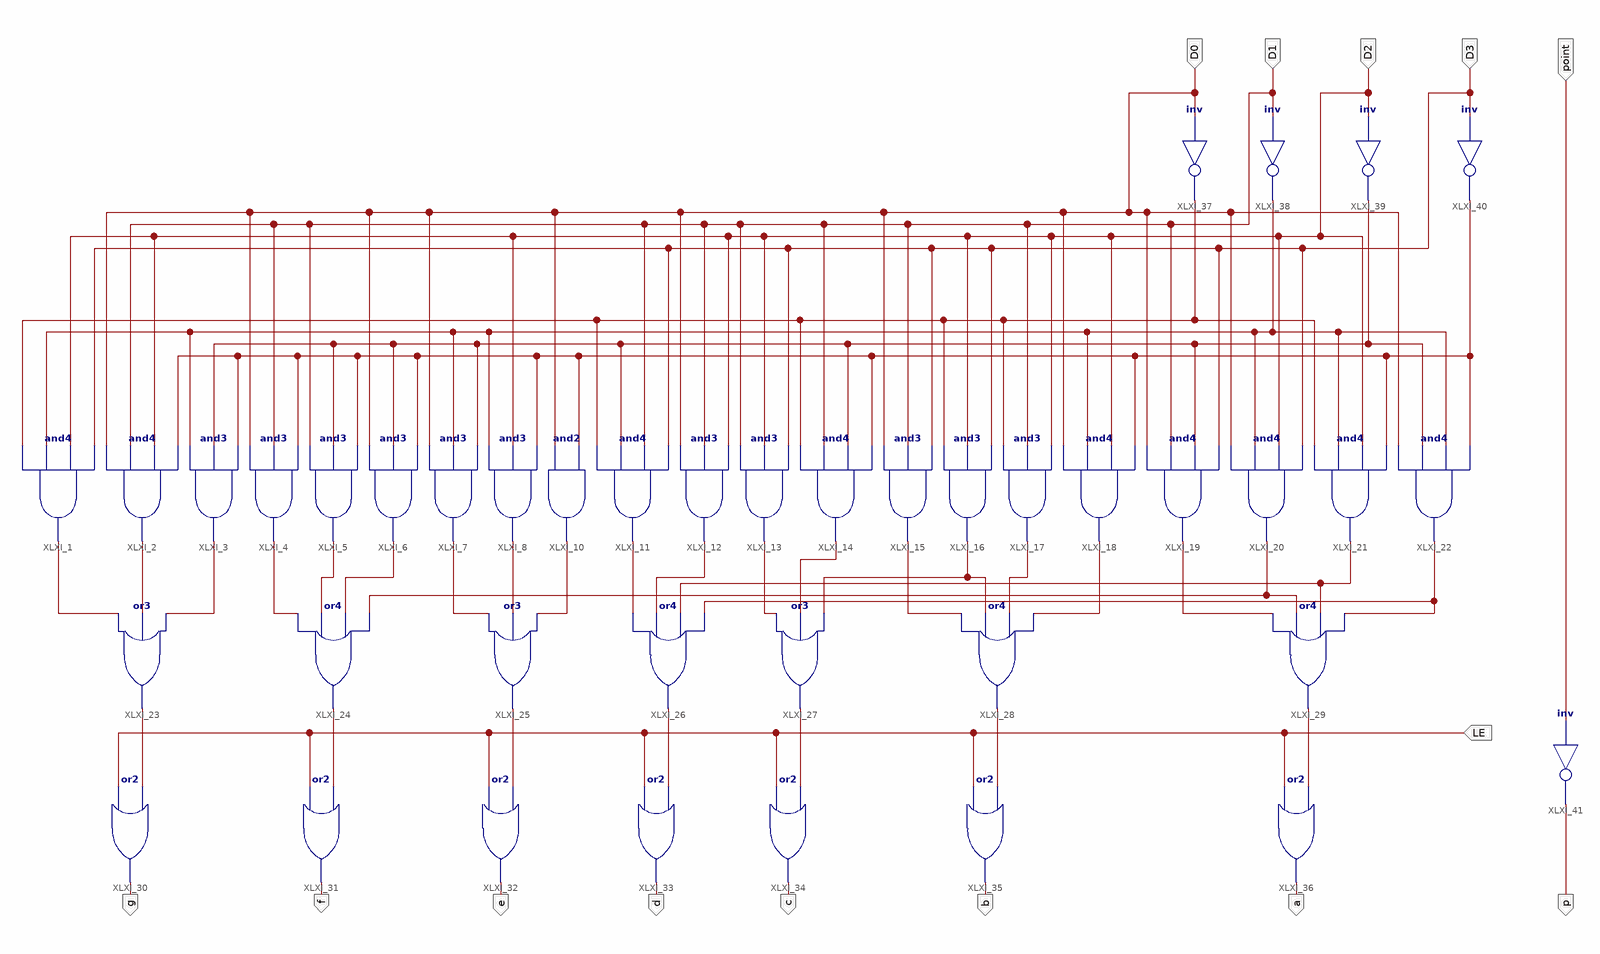
[diagram p0: schematic sheet 1]
// Xilinx ISE schematic MyMC14495.sch (kintex7) as structural Verilog: 40 symbols, 14 ports
module MyMC14495 (
  input  D2,
  input  D3,
  input  D0,
  input  D1,
  input  point,
  input  LE,
  output g,
  output f,
  output e,
  output d,
  output c,
  output b,
  output a,
  output p
);

  wire XLXN_10, XLXN_11, XLXN_13, XLXN_14, XLXN_38, XLXN_39, XLXN_40, XLXN_41, XLXN_42, XLXN_43, XLXN_44,
       XLXN_45, XLXN_46, XLXN_47, XLXN_48, XLXN_49, XLXN_50, XLXN_51, XLXN_53, XLXN_54, XLXN_55, XLXN_58,
       XLXN_59, XLXN_60, XLXN_61, XLXN_62, XLXN_63, XLXN_64, XLXN_65, XLXN_66, XLXN_67, XLXN_68;

  and XLXI_1 (XLXN_38, XLXN_10, XLXN_11, D2, D3);
  and XLXI_2 (XLXN_39, D0, D1, D2, XLXN_13);
  and XLXI_3 (XLXN_40, XLXN_11, XLXN_14, XLXN_13);
  and XLXI_4 (XLXN_41, D0, D1, XLXN_13);
  and XLXI_5 (XLXN_42, D1, XLXN_14, XLXN_13);
  and XLXI_6 (XLXN_43, D0, XLXN_14, XLXN_13);
  and XLXI_7 (XLXN_44, D0, XLXN_11, XLXN_14);
  and XLXI_8 (XLXN_45, XLXN_11, D2, XLXN_13);
  and XLXI_10 (XLXN_46, D0, XLXN_13);
  and XLXI_11 (XLXN_47, XLXN_10, XLXN_14, D1, D3);
  and XLXI_12 (XLXN_48, D0, D1, D2);
  and XLXI_13 (XLXN_49, D1, D2, D3);
  and XLXI_14 (XLXN_50, XLXN_10, D1, XLXN_14, XLXN_13);
  and XLXI_15 (XLXN_51, D0, D1, D3);
  and XLXI_16 (XLXN_61, XLXN_10, D2, D3);
  and XLXI_17 (XLXN_53, XLXN_10, D1, D2);
  and XLXI_18 (XLXN_54, D0, XLXN_11, D2, XLXN_13);
  and XLXI_19 (XLXN_55, D0, D1, XLXN_14, D3);
  and XLXI_20 (XLXN_59, D0, XLXN_11, D2, D3);
  and XLXI_21 (XLXN_60, XLXN_10, XLXN_11, D2, XLXN_13);
  and XLXI_22 (XLXN_58, D0, XLXN_14, XLXN_11, XLXN_13);
  or XLXI_23 (XLXN_62, XLXN_38, XLXN_39, XLXN_40);
  or XLXI_24 (XLXN_63, XLXN_41, XLXN_42, XLXN_43, XLXN_59);
  or XLXI_25 (XLXN_64, XLXN_44, XLXN_45, XLXN_46);
  or XLXI_26 (XLXN_65, XLXN_47, XLXN_48, XLXN_60, XLXN_58);
  or XLXI_27 (XLXN_66, XLXN_49, XLXN_50, XLXN_61);
  or XLXI_28 (XLXN_67, XLXN_51, XLXN_61, XLXN_53, XLXN_54);
  or XLXI_29 (XLXN_68, XLXN_55, XLXN_59, XLXN_60, XLXN_58);
  or XLXI_30 (g, LE, XLXN_62);
  or XLXI_31 (f, LE, XLXN_63);
  or XLXI_32 (e, LE, XLXN_64);
  or XLXI_33 (d, LE, XLXN_65);
  or XLXI_34 (c, LE, XLXN_66);
  or XLXI_35 (b, LE, XLXN_67);
  or XLXI_36 (a, LE, XLXN_68);
  not XLXI_37 (XLXN_10, D0);
  not XLXI_38 (XLXN_11, D1);
  not XLXI_39 (XLXN_14, D2);
  not XLXI_40 (XLXN_13, D3);
  not XLXI_41 (p, point);
endmodule
